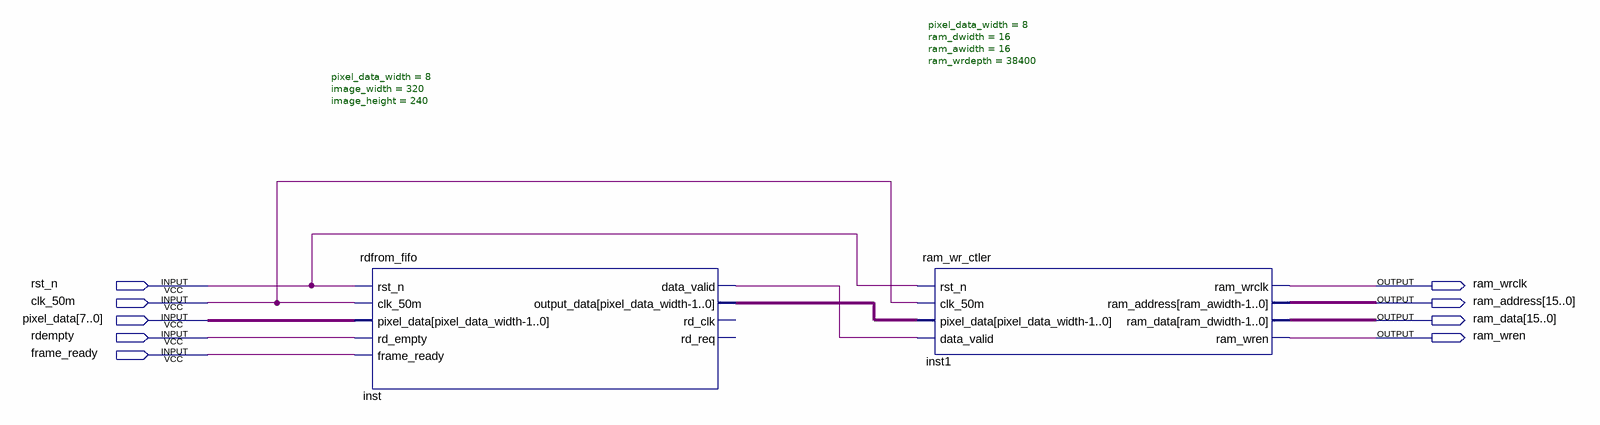
[diagram p0: schematic sheet]
// Quartus schematic fifo2ram_test.bdf as structural Verilog: 2 symbols, 9 pins
module fifo2ram_test (
  input  rst_n,
  input  clk_50m,
  input  [7:0] pixel_data,
  input  rdempty,
  input  frame_ready,
  output ram_wrclk,
  output [15:0] ram_address,
  output [15:0] ram_data,
  output ram_wren
);

  wire inst_data_valid;
  wire [7:0] inst_output_data;

  rdfrom_fifo #(.pixel_data_width(8), .image_width(320), .image_height(240)) inst (
    .rst_n(rst_n), .clk_50m(clk_50m), .pixel_data(pixel_data), .rd_empty(rdempty), .frame_ready(frame_ready),
    .data_valid(inst_data_valid), .output_data(inst_output_data));  // open: rd_clk, rd_req
  ram_wr_ctler #(.pixel_data_width(8), .ram_dwidth(16), .ram_awidth(16), .ram_wrdepth(38400)) inst1 (
    .rst_n(rst_n), .clk_50m(clk_50m), .pixel_data(inst_output_data), .data_valid(inst_data_valid),
    .ram_wrclk(ram_wrclk), .ram_address(ram_address), .ram_data(ram_data), .ram_wren(ram_wren));
endmodule
